# Altium schematic sheet CanAndSupply.SchDoc
size 420 x 297 mm; Address1: Address1; Address2: Address2; Address3: Address3; Address4: Address4; DocumentNumber: АБВГ.123456.001 Э3; SheetNumber: 5; SheetTotal: 5; Scale: 1:1; DocumentType: Схема электрическая принципиальная; FirstReferrence: АБВГ.123456.001
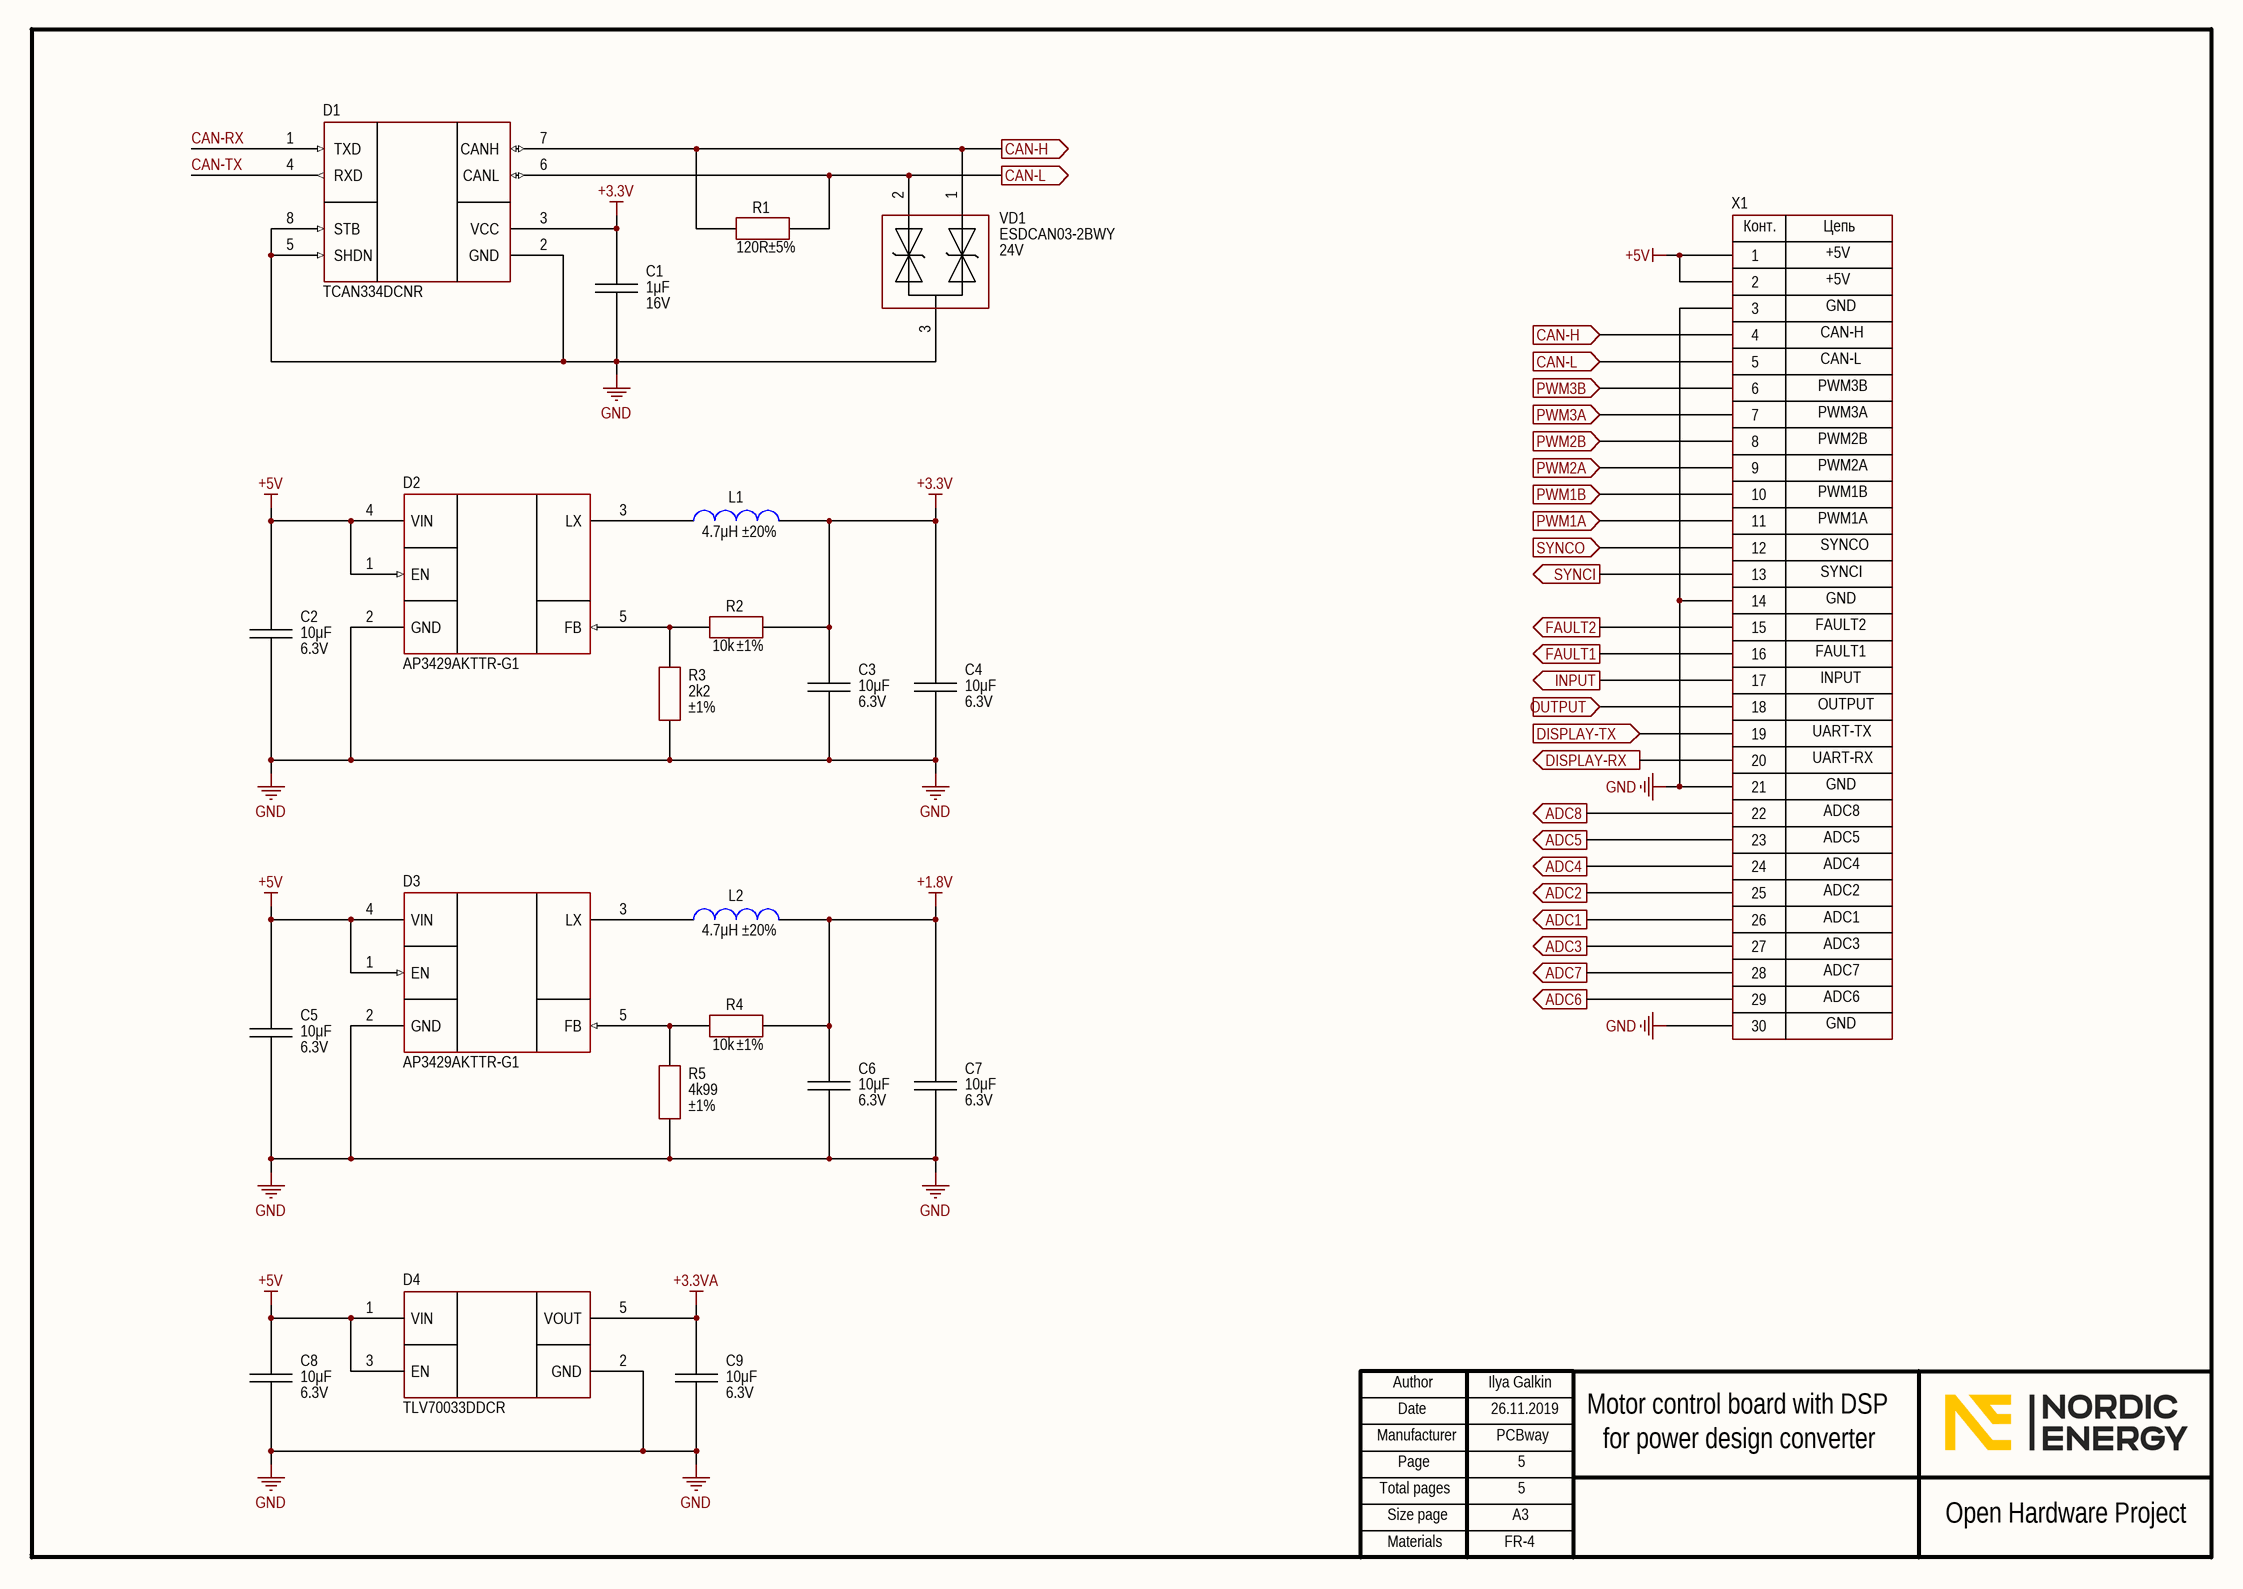
[diagram p0: CanAndSupply.SchDoc]

## Parts
C1  value 1μF  Voltage: 16V  [CAP: 0603]
C2  value 10μF  Voltage: 6.3V  [CAP: 0603]
C3  value 10μF  Voltage: 6.3V  [CAP: 0603]
C4  value 10μF  Voltage: 6.3V  [CAP: 0603]
C5  value 10μF  Voltage: 6.3V  [CAP: 0603]
C6  value 10μF  Voltage: 6.3V  [CAP: 0603]
C7  value 10μF  Voltage: 6.3V  [CAP: 0603]
C8  value 10μF  Voltage: 6.3V  [CAP: 0603]
C9  value 10μF  Voltage: 6.3V  [CAP: 0603]
D1  (no value)  [SOT23-8]
D2  (no value)  [SOT23-5]
D3  (no value)  [SOT23-5]
D4  (no value)  [SOT23-5]
L1  value 4.7μH  Tolerance: ±20%  [IND: SRP2510A]
L2  value 4.7μH  Tolerance: ±20%  [IND: SRP2510A]
R1  value 120R  Tolerance: ±5%  [RES: 0603]
R2  value 10k  Tolerance: ±1%  [RES: 0603]
R3  value 2k2  Tolerance: ±1%  [RES: 0603]
R4  value 10k  Tolerance: ±1%  [RES: 0603]
R5  value 4k99  Tolerance: ±1%  [RES: 0603]
VD1  Voltage: 24V  PartNumber: ESDCAN03-2BWY  [SC-70]
X1  (no value)  [CON: PLS-30R]

## Ports
ADC1 (out), ADC2 (out), ADC3 (out), ADC4 (out), ADC5 (out), ADC6 (out), ADC7 (out), ADC8 (out), CAN-H (in), CAN-H (out), CAN-L (in), CAN-L (out), DISPLAY-RX (out), DISPLAY-TX (in), FAULT1 (out), FAULT2 (out), INPUT (out), OUTPUT (in), PWM1A (in), PWM1B (in), PWM2A (in), PWM2B (in), PWM3A (in), PWM3B (in), SYNCI (out), SYNCO (in)

## Nets
+1.8V: C6.2 C7.2 L2.1 R4.1
+3.3V: C1.2 C3.2 C4.2 D1.3(VCC) L1.1 R2.1
+3.3VA: C9.2 D4.5(VOUT)
+5V: C2.2 C5.2 C8.2 D2.1(EN) D2.4(VIN) D3.1(EN) D3.4(VIN) D4.1(VIN) D4.3(EN) X1.1 X1.2
GND: C1.1 C2.1 C3.1 C4.1 C5.1 C6.1 C7.1 C8.1 C9.1 D1.2(GND) D1.5(SHDN) D1.8(STB) D2.2(GND) D3.2(GND) D4.2(GND) R3.1 R5.1 VD1.3 X1.3 X1.14 X1.21 X1.30
ADC1: X1.26 ; port ADC1
ADC2: X1.25 ; port ADC2
ADC3: X1.27 ; port ADC3
ADC4: X1.24 ; port ADC4
ADC5: X1.23 ; port ADC5
ADC6: X1.29 ; port ADC6
ADC7: X1.28 ; port ADC7
ADC8: X1.22 ; port ADC8
CAN-H: D1.7(CANH) R1.1 VD1.1 X1.4 ; port CAN-H
CAN-L: D1.6(CANL) R1.2 VD1.2 X1.5 ; port CAN-L
CAN-RX: D1.1(TXD)
CAN-TX: D1.4(RXD)
DISPLAY-RX: X1.20 ; port DISPLAY-RX
DISPLAY-TX: X1.19 ; port DISPLAY-TX
FAULT1: X1.16 ; port FAULT1
FAULT2: X1.15 ; port FAULT2
INPUT: X1.17 ; port INPUT
OUTPUT: X1.18 ; port OUTPUT
PWM1A: X1.11 ; port PWM1A
PWM1B: X1.10 ; port PWM1B
PWM2A: X1.9 ; port PWM2A
PWM2B: X1.8 ; port PWM2B
PWM3A: X1.7 ; port PWM3A
PWM3B: X1.6 ; port PWM3B
SYNCI: X1.13 ; port SYNCI
SYNCO: X1.12 ; port SYNCO
NetD2_3: D2.3(LX) L1.2
NetD2_5: D2.5(FB) R2.2 R3.2
NetD3_3: D3.3(LX) L2.2
NetD3_5: D3.5(FB) R4.2 R5.2

## Notes on the sheet
- +5V
- GND
- PWM3B
- CAN-H
- CAN-L
- PWM2B
- PWM3A
- PWM1A
- PWM1B
- PWM2A
- SYNCI
- SYNCO
- FAULT1
- FAULT2
- OUTPUT
- INPUT
- UART-TX
- UART-RX
- ADC8
- ADC5
- ADC4
- ADC2
- ADC1
- ADC7
- ADC6
- ADC3
- Ilya Galkin
- 26.11.2019
- PCBway
- 5
- Motor control board with DSP
- for power design converter
- FR-4
- Author
- Manufacturer
- Date
- Page
- Total pages
- Size page
- A3
- Open Hardware Project
- Materials
- (in symbol PLS-30) Конт.; Цепь

## Library data of the parts
C1 = Ceramic_0603: Manufacturer: Samsung; PartNumber: CL10B105KO8NNNC; ValueManufacturerPartNumber: Ceramic capacitor, 1μF, X7R, ±10%, 16V, 0603, -55...+125°C; TypeCapacitor: Ceramic capacitor; Tolerance: ±10%; TypeDielectric: X7R; Package: 0603; HelpURL: https://www.digikey.com/product-detail/en/samsung-electro-mechanics/CL10B105KO8NNNC/1276-1019-1-ND/3889105; Temperature: -55...+125°C
C2-C9 = Ceramic_0603: Manufacturer: Samsung; PartNumber: CL10B106MQ8NRNC; ValueManufacturerPartNumber: Ceramic capacitor, 10μF, X7R, ±10%, 6.3V, 0603, -55...+125°C; TypeCapacitor: Ceramic capacitor; Tolerance: ±10%; TypeDielectric: X7R; Package: 0603; HelpURL: https://www.digikey.com/product-detail/en/samsung-electro-mechanics/CL10B106MQ8NRNC/1276-1948-1-ND/3890034; Temperature: -55...+125°C
D1 = TCAN334DCNR: CAN; Manufacturer: Texas Instruments; ValueManufacturerPartNumber: IC CAN transceiver, 1Mbps, Half-duplex, 3...3.6V, -40...+125°C, SOT23-8; Supply: 3...3.6V; DataRate: 1Mbps; TypeDuplex: Half-duplex; HelpURL: https://www.digikey.com/product-detail/en/texas-instruments/TCAN334DCNR/296-47830-1-ND/8133179; Package: SOT23-8; ComponentType: IC CAN transceiver; Temperature: -40...+125°C; PartNumber: TCAN334DCNR
D2 D3 = AP3429AKTTR-G1: Buck converter; Manufacturer: Diodes Incorporated; ValueManufacturerPartNumber: DC/DC buck converter, input 2.7...5.5V, 1MHz, output 0.6...5V, 2A, -40...+85°C, SOT23-6; VoltageInput: input 2.7...5.5V; Frequency: 1MHz; CurrentOutput: 2A; VoltageOutput: output 0.6...5V; HelpURL: https://www.digikey.com/product-detail/en/diodes-incorporated/AP3429AKTTR-G1/AP3429AKTTR-G1DICT-ND/5359842; Package: SOT23-6; ComponentType: DC/DC buck converter; Temperature: -40...+85°C; PartNumber: AP3429AKTTR-G1
D4 = TLV70033DDCR: Linear voltage regulator; Manufacturer: Texas Instruments; ValueManufacturerPartNumber: Linear voltage regulator, input 5.5V, 0.25V, output 3.3V, 200 mA, -40...+85°C, SOT-23-5; VoltageInput: input 5.5V; MaxDropout: 0.25V; CurrentOutput: 200 mA; VoltageOutput: output 3.3V; HelpURL: https://www.digikey.com/product-detail/en/texas-instruments/TLV70033DDCR/296-27937-1-ND/2440840; Package: SOT-23-5; ComponentType: Linear voltage regulator; Temperature: -40...+85°C; PartNumber: TLV70033DDCR
L1 L2 = Inductor_SRP2510A: Manufacturer: Bourns; PartNumber: SRP2510A-4R7M; ValueManufacturerPartNumber: Fixed inductor, 4.7μH, ±20%, SRP2510A, 1.36A, -40...+125°C; TypeInductor: Fixed inductor; MaxCurrent: 1.36A; Package: SRP2510A; HelpURL: https://www.digikey.com/product-detail/en/bourns-inc/SRP2510A-4R7M/SRP2510A-4R7MCT-ND/7354840; Temperature: -40...+125°C
R1 = Resistor_0603: Manufacturer: Yageo; PartNumber: RC0603JR-07120RL; ValueManufacturerPartNumber: Resistor film, 120R, ±5%, 0603, 0.1W, -55...+125°C; TypeResistor: Resistor film; Power: 0.1W; Package: 0603; HelpURL: https://www.digikey.com/product-detail/en/yageo/RC0603JR-07120RL/311-120GRCT-ND/729653; Temperature: -55...+125°C
R2 R4 = Resistor_0603: Manufacturer: Yageo; PartNumber: RC0603FR-0710KL; ValueManufacturerPartNumber: Resistor film, 10k, ±1%, 0603, 0.1W, -55...+125°C; TypeResistor: Resistor film; Power: 0.1W; Package: 0603; HelpURL: https://www.digikey.com/product-detail/en/yageo/RC0603FR-0710KL/311-10.0KHRCT-ND/729827; Temperature: -55...+125°C
R3 = Resistor_0603: Manufacturer: Yageo; PartNumber: RC0603FR-072K2L; ValueManufacturerPartNumber: Resistor film, 2k2, ±1%, 0603, 0.1W, -55...+125°C; TypeResistor: Resistor film; Power: 0.1W; Package: 0603; HelpURL: https://www.digikey.com/product-detail/en/yageo/RC0603FR-072K2L/311-2.20KHRCT-ND/729963; Temperature: -55...+125°C
R5 = Resistor_0603: Manufacturer: Yageo; PartNumber: RC0603FR-074K99L; ValueManufacturerPartNumber: Resistor film, 4k99, ±1%, 0603, 0.1W, -55...+125°C; TypeResistor: Resistor film; Power: 0.1W; Package: 0603; HelpURL: https://www.digikey.com/product-detail/en/yageo/RC0603FR-074K99L/311-4.99KHRCT-ND/730166; Temperature: -55...+125°C
VD1 = TVS_array: Manufacturer: Texas Instruments; ValueManufacturerPartNumber: Zener diode, 24V, 250W, 3A peak, 3pF, SC-70, -55...+175°C; TypeDiode: Zener diode; Current: 250W; VoltageDrop: 3A peak; RecoveryTime: 3pF; Package: SC-70; HelpURL: https://www.digikey.com/product-detail/en/stmicroelectronics/ESDCAN03-2BWY/497-15846-1-ND/5305256; Temperature: -55...+175°C
X1 = PLS-30: Manufacturer: Connfly; ValueManufacturerPartNumber: Connector, 30pin, 2.54mm, 500VAC, 3A; TypeConnector: Connector; VoltageMax: 500VAC; Pitch: 2.54mm; CurrentMax: 3A; Multichannel: 30pin; CommentText: "Разъем"; HelpURL: https://www.chipdip.ru/product/pls-40r-2; PartNumber: PLS-30